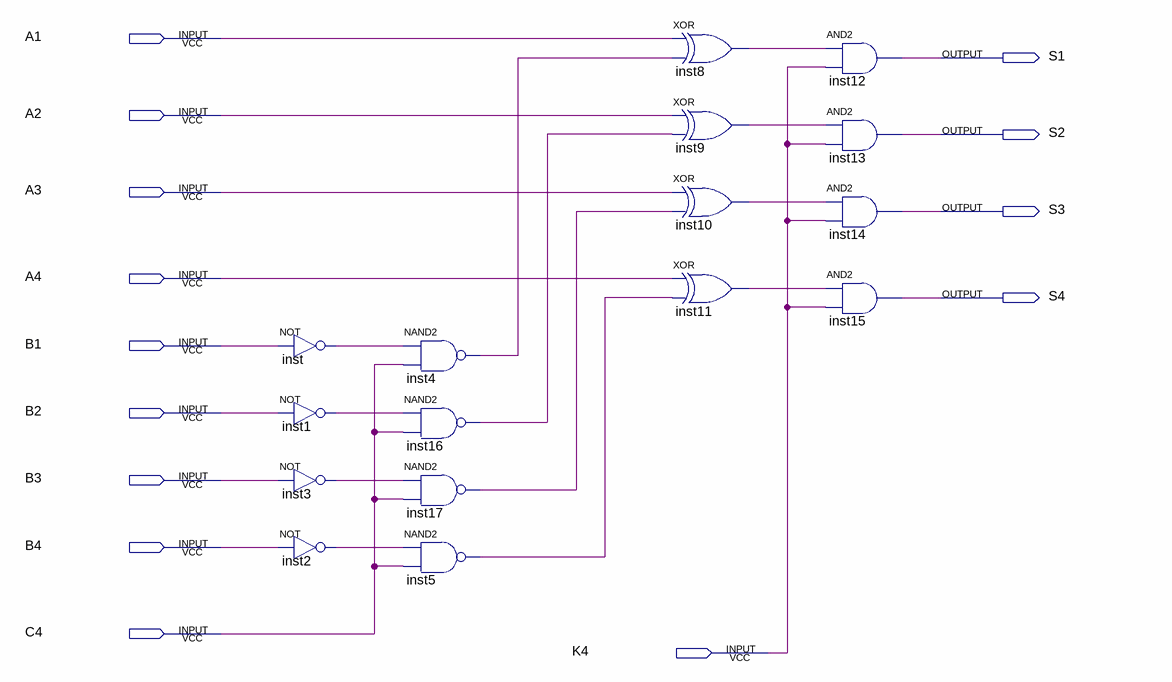
[diagram p0: schematic sheet]
// Quartus schematic Block5.bdf as structural Verilog: 16 symbols, 14 pins
module Block5 (
  input  A1,
  input  A2,
  input  A3,
  input  A4,
  input  B1,
  input  B2,
  input  B3,
  input  B4,
  input  C4,
  input  K4,
  output S1,
  output S2,
  output S3,
  output S4
);

  wire inst1_out, inst2_out, inst3_out, inst4_out, inst5_out, inst8_out, inst9_out, inst10_out, inst11_out,
       inst16_out, inst17_out, inst_out;

  not inst (inst_out, B1);
  not inst1 (inst1_out, B2);
  not inst3 (inst3_out, B3);
  not inst2 (inst2_out, B4);
  nand inst4 (inst4_out, inst_out, C4);
  nand inst16 (inst16_out, inst1_out, C4);
  nand inst17 (inst17_out, inst3_out, C4);
  nand inst5 (inst5_out, inst2_out, C4);
  xor inst8 (inst8_out, A1, inst4_out);
  xor inst9 (inst9_out, A2, inst16_out);
  xor inst10 (inst10_out, A3, inst17_out);
  xor inst11 (inst11_out, A4, inst5_out);
  and inst12 (S1, inst8_out, K4);
  and inst13 (S2, inst9_out, K4);
  and inst14 (S3, inst10_out, K4);
  and inst15 (S4, inst11_out, K4);
endmodule
